# EAGLE design LED_Platine_2x4 (EAGLE 5.00)
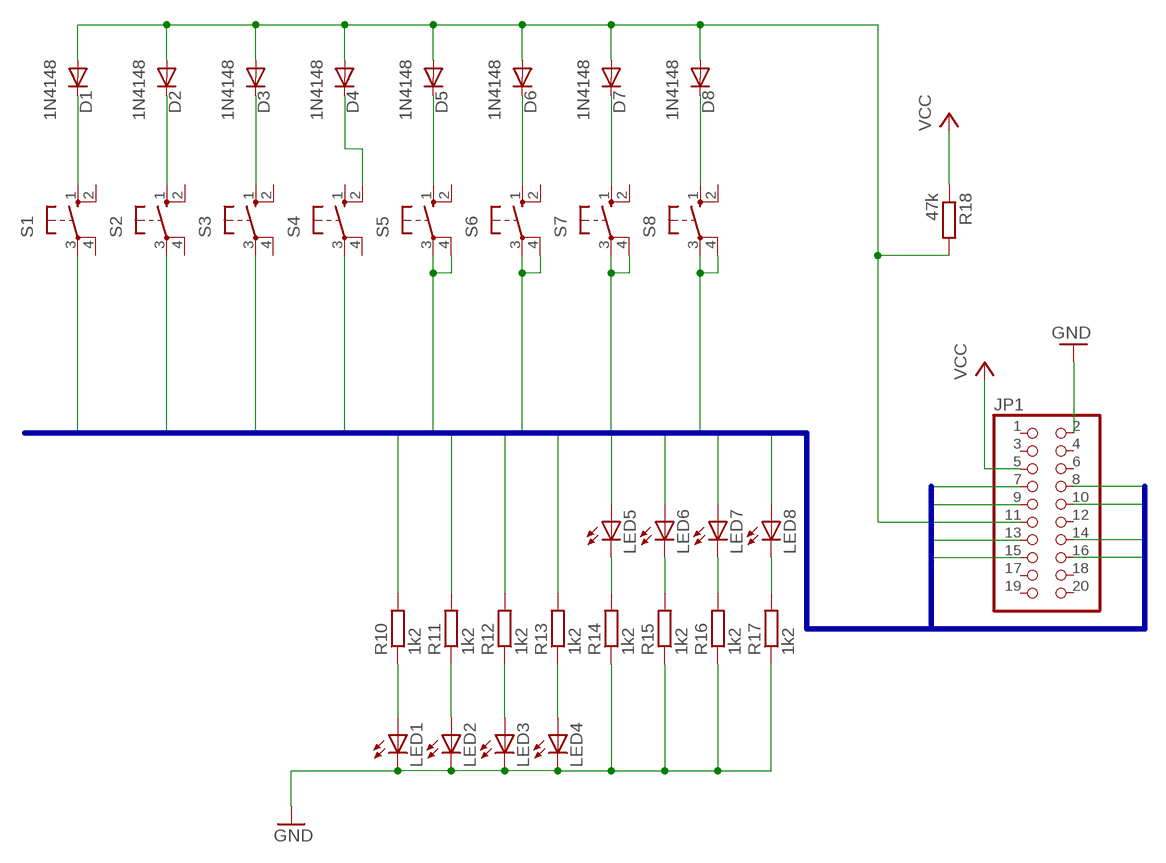
[diagram p0: schematic, sheet 1]

## Parts
D1  1N4148  [DO35-10]
D2  1N4148  [DO35-10]
D3  1N4148  [DO35-10]
D4  1N4148  [DO35-10]
D5  1N4148  [DO35-10]
D6  1N4148  [DO35-10]
D7  1N4148  [DO35-10]
D8  1N4148  [DO35-10]
JP1  PINHD-2X10  [2X10]
LED1  LED3MM  [LED3MM]
LED2  LED3MM  [LED3MM]
LED3  LED3MM  [LED3MM]
LED4  LED3MM  [LED3MM]
LED5  LED3MM  [LED3MM]
LED6  LED3MM  [LED3MM]
LED7  LED3MM  [LED3MM]
LED8  LED3MM  [LED3MM]
R10  1k2  R-EU_0207/10  [0207/10]
R11  1k2  R-EU_0207/10  [0207/10]
R12  1k2  R-EU_0207/10  [0207/10]
R13  1k2  R-EU_0207/10  [0207/10]
R14  1k2  R-EU_0207/10  [0207/10]
R15  1k2  R-EU_0207/10  [0207/10]
R16  1k2  R-EU_0207/10  [0207/10]
R17  1k2  R-EU_0207/10  [0207/10]
R18  47k  R-EU_0207/10  [0207/10]
S1  10-XX  [B3F-10XX]
S2  10-XX  [B3F-10XX]
S3  10-XX  [B3F-10XX]
S4  10-XX  [B3F-10XX]
S5  10-XX  [B3F-10XX]
S6  10-XX  [B3F-10XX]
S7  10-XX  [B3F-10XX]
S8  10-XX  [B3F-10XX]

## Nets
GND: JP1.2 LED1.K(C) LED2.K(C) LED3.K(C) LED4.K(C) R14.1 R15.1 R16.1 R17.1
N$1: D1.C S1.1(S)
N$2: D2.C S2.1(S)
N$3: D3.C S3.1(S)
N$4: D4.C S4.2(S1)
N$6: D5.C S5.1(S)
N$7: D6.C S6.1(S)
N$8: D7.C S7.1(S)
N$10: D8.C S8.1(S)
N$13: D1.A D2.A D3.A D4.A D5.A D6.A D7.A D8.A JP1.11 R18.2
N$14: LED5.K(C) R14.2
N$15: LED1.A R10.1
N$16: LED6.K(C) R15.2
N$17: LED7.K(C) R16.2
N$18: LED8.K(C) R17.2
N$20: LED2.A R11.1
N$21: LED3.A R12.1
N$22: LED4.A R13.1
P0.0: JP1.7 R10.2 S1.3(P)
P0.1: JP1.8 R11.2 S2.3(P)
P0.2: JP1.9 R12.2 S3.3(P)
P0.3: JP1.10 R13.2 S4.3(P)
P0.4: JP1.13 LED5.A S5.3(P) S5.4(P1)
P0.5: JP1.14 LED6.A S6.3(P) S6.4(P1)
P0.6: JP1.15 LED7.A S7.3(P) S7.4(P1)
P0.7: JP1.16 LED8.A S8.3(P) S8.4(P1)
VCC: JP1.5 R18.1
Unconnected: JP1.1 JP1.3 JP1.4 JP1.6 JP1.12 JP1.17 JP1.18 JP1.19 JP1.20 S1.2(S1) S1.4(P1) S2.2(S1) S2.4(P1) S3.2(S1) S3.4(P1) S4.1(S) S4.4(P1) S5.2(S1) S6.2(S1) S7.2(S1) S8.2(S1)

## Buses
P0.[0..7]

## Library data of the parts
D1-D8 = diode:1N4148: DIODE high speed (Philips)
JP1 = pinhead:PINHD-2X10: PIN HEADER
LED1-LED8 = led:LED: LED OSRAM: - CHIPLED LG R971, LG N971, LY N971, LG Q971, LY Q971, LO R971, LY R971 LH N974, LH R974 LS Q976, LO Q976, LY Q976 LO Q996 - Hyper CHIPLED LW Q18S LB Q993, LB Q99A, LB R99A - SideLED LS A670, LO A670, LY A670, LG A670, LP A670 LB A673, LV A673, LT A673, LW A673 LH A674 LY A675 LS A676, LA A676, LO A676, LY A676, LW A676 LS A679, LY A679, LG A679 - Hyper Micro SIDELED® LS Y876, LA Y876, LO Y876, LY Y876 LT Y87S - SmartLED LW L88C, LW L88S LB L89C, LB L89S, LG L890 LS L89K, LO L89K, LY L89K LS L896, LA L896, LO L896, LY L896 - TOPLED LS T670, LO T670, LY T670, LG T670, LP T670 LSG T670, LSP T670, LSY T670, LOP T670, LYG T670 LG T671, LOG T671, LSG T671 LB T673, LV T673, LT T673, LW T673 LH T674 LS T676, LA T676, LO T676, LY T676, LB T676, LH T676, LSB T676, LW T676 LB T67C, LV T67C, LT T67C, LS T67K, LO T67K, LY T67K, LW E67C LS E67B, LA E67B, LO E67B, LY E67B, LB E67C, LV E67C, LT E67C LW T67C LS T679, LY T679, LG T679 LS T770, LO T770, LY T770, LG T770, LP T770 LB T773, LV T773, LT T773, LW T773 LH T774 LS E675, LA E675, LY E675, LS T675 LS T776, LA T776, LO T776, LY T776, LB T776 LHGB T686 LT T68C, LB T68C - Hyper Mini TOPLED® LB M676 - Mini TOPLED Santana® LG M470 LS M47K, LO M47K, LY M47K Source: http://www.osram.convergy.de - LUMILED® LXK2-PW12-R00, LXK2-PW12-S00, LXK2-PW14-U00, LXK2-PW14-V00 LXK2-PM12-R00, LXK2-PM12-S00, LXK2-PM14-U00 LXK2-PE12-Q00, LXK2-PE12-R00, LXK2-PE12-S00, LXK2-PE14-T00, LXK2-PE14-U00 LXK2-PB12-K00, LXK2-PB12-L00, LXK2-PB12-M00, LXK2-PB14-N00, LXK2-PB14-P00, LXK2-PB14-Q00 LXK2-PR12-L00, LXK2-PR12-M00, LXK2-PR14-Q00, LXK2-PR14-R00 LXK2-PD12-Q00, LXK2-PD12-R00, LXK2-PD12-S00 LXK2-PH12-R00, LXK2-PH12-S00 LXK2-PL12-P00, LXK2-PL12-Q00, LXK2-PL12-R00 Source: www.luxeon.com
R10-R18 = rcl:R-EU_: RESISTOR, European symbol
S1-S8 = switch-omron:10-XX: OMRON SWITCH

## Board
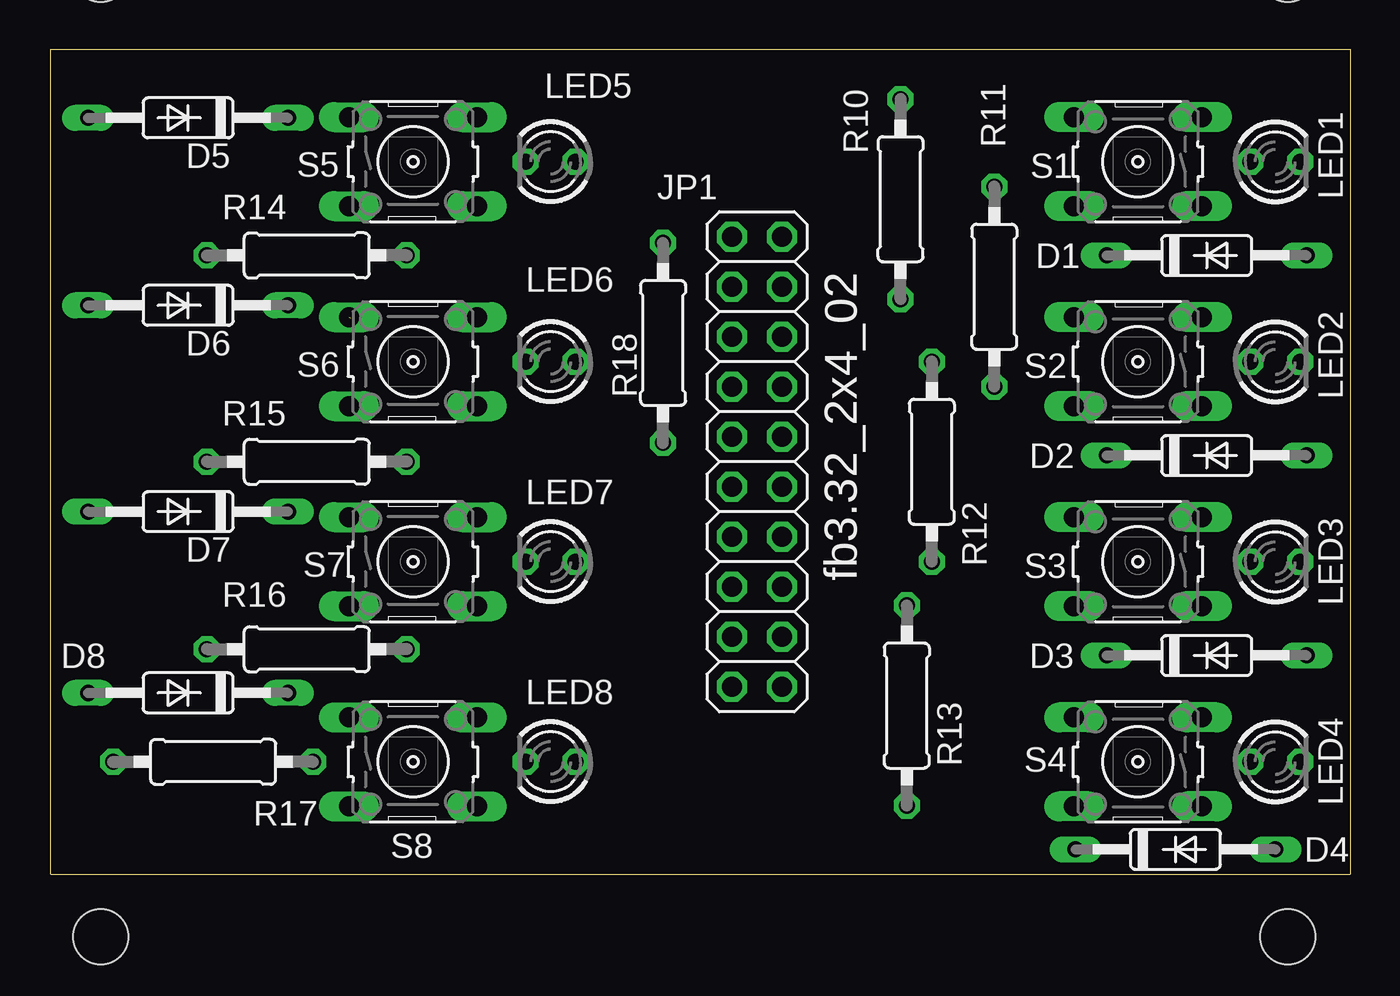
[diagram p1: board, top side]
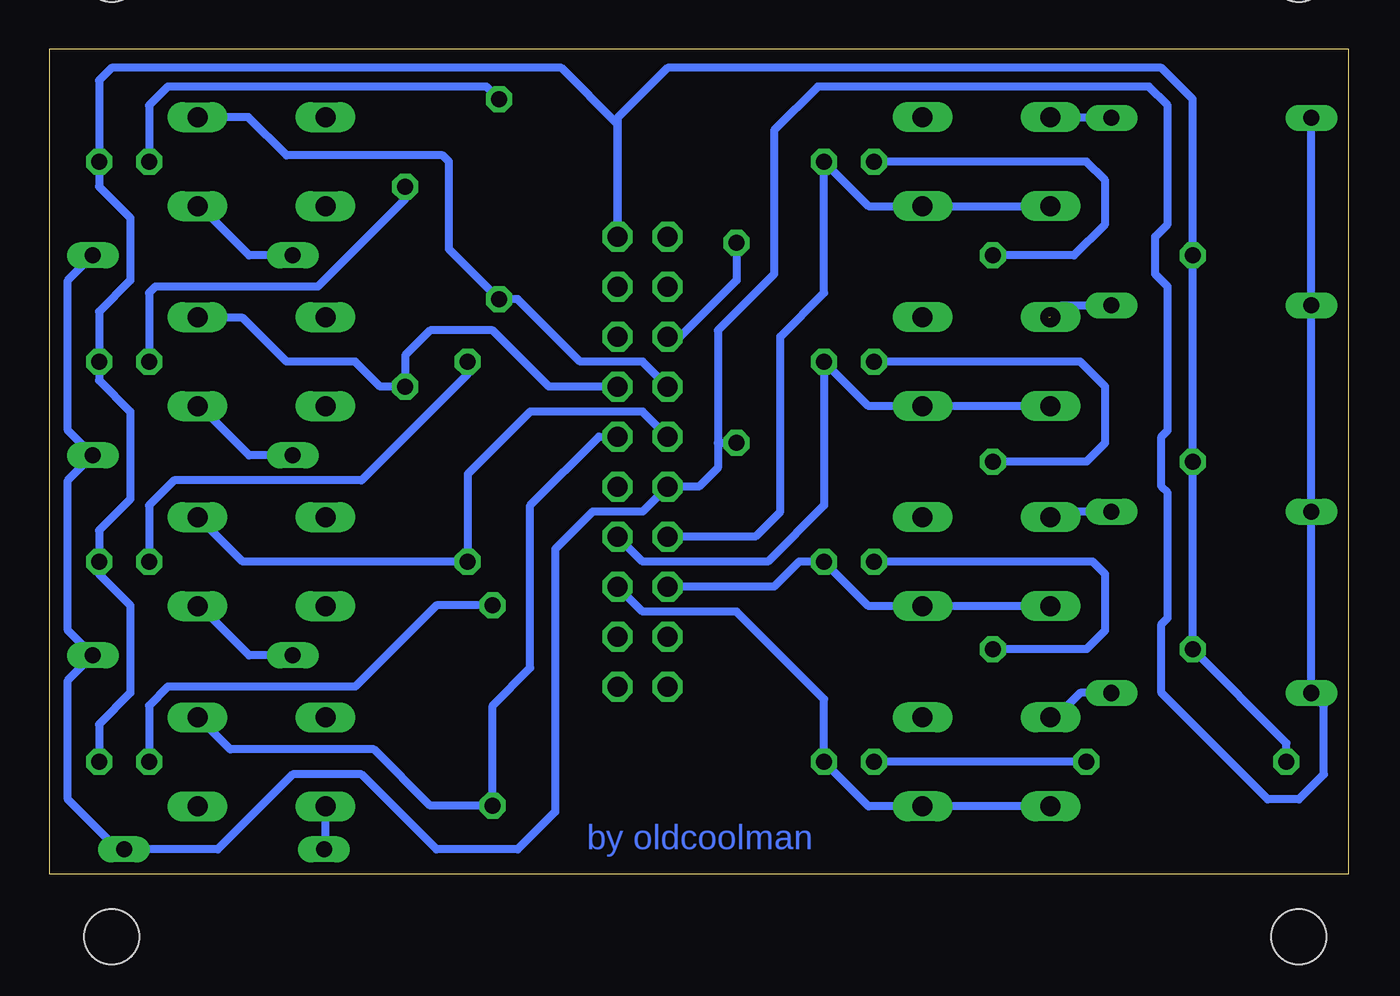
[diagram p2: board, bottom side, seen from below]

Size 66.04 x 41.91 mm. Coordinates in mm from the lower left corner, seen from the top.
Outline: 0,0 0,41.91 66.04,41.91 66.04,0 0,0
Copper layers (1*16): Top 0.035mm / dielectric 1.5mm / Bottom 0.035mm
Design rules "default": minimum track width 10mil, minimum drill 24mil, track to track 12mil, track to pad 12mil, pad to pad 12mil, via to via 12mil, smd to smd 8mil, copper to edge 20mil, drill to drill 8mil, minimum pad ring 10mil, minimum via ring 8mil, stop-mask expansion 4mil, vias tented up to drill 0mil, thermal gap 10mil
Holes 2.8 mm at 2.54,45.72 62.87,45.72 62.87,-3.17 2.54,-3.17

### Footprints (pad centres in the part's own frame; a part is rotated, then mirrored left to right if it is on the bottom)
DO35-10 = drill 0.813 long: A 5.08,0; C -5.08,0
2X10 = drill 1.016 octagon: 1 -11.43,-1.27; 2 -11.43,1.27; 3 -8.89,-1.27; 4 -8.89,1.27; 5 -6.35,-1.27; 6 -6.35,1.27; 7 -3.81,-1.27; 8 -3.81,1.27; 9 -1.27,-1.27; 10 -1.27,1.27; 11 1.27,-1.27; 12 1.27,1.27; 13 3.81,-1.27; 14 3.81,1.27; 15 6.35,-1.27; 16 6.35,1.27; 17 8.89,-1.27; 18 8.89,1.27; 19 11.43,-1.27; 20 11.43,1.27
LED3MM = drill 0.813 octagon: A -1.27,0; K 1.27,0
0207/10 = drill 0.813 octagon: 1 -5.08,0; 2 5.08,0
B3F-10XX = drill 1.016 long: 1 -3.251,2.261; 2 3.251,2.261; 3 -3.251,-2.261; 4 3.251,-2.261

### Placement (x,y rotation side)
D1  58.74,31.43 0 top
D2  58.74,21.27 0 top
D3  58.74,11.11 0 top
D4  57.15,1.27 0 top
D5  6.98,38.42 180 top
D6  6.98,28.89 180 top
D7  6.98,18.41 180 top
D8  6.98,9.21 180 top
JP1  35.88,20.95 270 top
LED1  62.23,36.2 0 top
LED2  62.23,26.03 0 top
LED3  62.23,15.87 0 top
LED4  62.23,5.71 0 top
LED5  25.4,36.2 180 top
LED6  25.4,26.03 180 top
LED7  25.4,15.87 180 top
LED8  25.4,5.71 180 top
R10  43.18,34.29 270 top
R11  47.94,29.84 270 top
R12  44.77,20.95 270 top
R13  43.5,8.57 270 top
R14  13.02,31.43 0 top
R15  13.02,20.95 0 top
R16  13.02,11.43 0 top
R17  8.25,5.71 0 top
R18  31.11,26.99 270 top
S1  55.25,36.2 180 top
S2  55.25,26.03 180 top
S3  55.25,15.87 180 top
S4  55.25,5.71 180 top
S5  18.42,36.2 0 top
S6  18.42,26.03 0 top
S7  18.42,15.87 0 top
S8  18.42,5.71 0 top

### Tracks (layer width: path | path; a pad name or v marks a point on that pad's centre or on a via)
GND
  Bottom 0.406: R17.1 3.18,6.67 R16.1 R15.1 R14.1 7.94,39.37 9.52,40.96 34.61,40.96 37.15,38.42 JP1.2 37.15,38.1 40,40.96 62.87,40.96 63.5,40.32 LED1.K 63.5,34.92 61.91,33.34 61.91,30.16 63.5,28.57 LED2.K 63.5,25.08 61.91,23.49 61.91,19.05 63.5,17.46 LED3.K 63.5,15.24 61.91,13.65 61.91,9.21 63.5,7.62 LED4.K
N$1
  Bottom 0.406: S1.1 58.46,33.93 58.42,33.97 55.88,31.43 D1.C
N$2
  Bottom 0.406: S2.1 58.46,23.77 58.42,23.81 55.88,21.27 D2.C
N$3
  Bottom 0.406: S3.1 58.46,13.61 58.42,13.65 55.88,11.11 D3.C
N$4
  Bottom 0.406: S4.2 51.99,1.35 D4.C
N$5  (via drill 0.6)
  other vias: 2.54,45.72
N$6
  Bottom 0.406: S5.1 15.24,38.46 15.24,38.42 D5.C
N$7  (1 unrouted)
  Bottom 0.406: 15.24,28.26 14.61,28.89 D6.C
N$8
  Bottom 0.406: S7.1 15.16,18.34 15.24,18.42 D7.C
N$9  (via drill 0.6)
  other vias: 2.54,-3.17
N$10
  Bottom 0.406: S8.1 14.96,7.98 14.92,7.94 13.65,9.21 D8.C
N$11  (via drill 0.6)
  other vias: 62.87,45.72
N$12  (via drill 0.6)
  other vias: 62.87,-3.17
N$13
  Bottom 0.406: D5.A D6.A D7.A D8.A 1.27,8.57 1.27,5.08 2.54,3.81 4.13,3.81 9.52,9.21 9.52,12.7 9.21,13.02 9.21,19.37 9.52,19.69 9.52,22.22 9.21,22.54 9.21,29.85 9.84,30.48 9.84,32.39 9.21,33.02 9.21,39.05 10.16,40 26.99,40 29.21,37.78 29.21,30.48 32.07,27.62 32.07,21.91 | 32.07,21.91 32.07,20.64 33.02,19.69 JP1.11 35.88,18.42 38.42,18.42 40.32,16.51 40.32,3.17 42.23,1.27 46.36,1.27 50.17,5.08 53.66,5.08 57.47,1.27 D4.A 62.55,1.27 65.09,3.81 65.09,9.84 D3.A 65.09,12.38 65.09,20 D2.A 65.09,22.54 65.09,30.16 D1.A | 32.07,21.91 R18.2
N$14
  Bottom 0.406: LED5.K 13.33,36.2 12.38,35.24 12.38,33.02 13.97,31.43 R14.2
N$15
  Bottom 0.406: R10.1 43.81,40 60.01,40 60.96,39.05 LED1.A
N$16
  Bottom 0.406: LED6.K 13.65,26.03 12.38,24.77 12.38,21.91 13.33,20.96 R15.2
N$17
  Bottom 0.406: LED7.K 13.02,15.87 12.38,15.24 12.38,12.38 13.33,11.43 R16.2
N$18
  Bottom 0.406: R17.2 LED8.K
N$20
  Bottom 0.406: R11.1 47.94,34.29 52.39,29.85 60.64,29.85 60.96,29.53 LED2.A
N$21
  Bottom 0.406: R12.1 44.77,25.4 50.17,20 59.69,20 60.96,18.73 60.96,16.19 | 60.96,16.19 60.64,15.87 LED3.A 60.96,16.19
N$22
  Bottom 0.406: R13.1 46.36,13.65 50.48,9.53 60.01,9.53 60.96,8.57 LED4.A
P0.0
  Bottom 0.406: S1.3 55.92,38.46 53.98,36.51 46.04,36.51 45.72,36.2 45.72,31.75 R10.2 42.23,29.21 39.05,26.03 35.88,26.03 JP1.7
P0.1
  Bottom 0.406: S2.3 58.46,28.3 58.42,28.26 56.2,28.26 53.98,26.03 50.48,26.03 49.21,24.77 R11.2 47.94,26.35 46.67,27.62 43.5,27.62 40.64,24.77 JP1.8
P0.2
  Bottom 0.406: JP1.9 35.88,23.49 41.59,23.49 44.77,20.32 R12.2 56.2,15.87 58.46,18.14 S3.3
P0.3
  Bottom 0.406: JP1.10 38.1,22.22 41.59,18.73 41.59,10.48 43.5,8.57 R13.2 46.67,3.49 49.53,6.35 56.83,6.35 58.46,7.98 S4.3
P0.4
  Bottom 0.406: S5.4 24.41,33.93 LED5.A 26.67,29.53 28.89,27.31 28.89,18.42 30.16,17.15 JP1.13 | S5.4 21.59,33.93 | 21.59,33.93 S5.3 | 21.59,33.93 21.59,33.97 21.63,33.97 S5.4
P0.5
  Bottom 0.406: S6.3 21.59,23.77 | 21.59,23.77 S6.4 | S6.4 24.41,23.77 LED6.A 26.67,18.73 29.53,15.87 35.88,15.87 JP1.14 | 21.59,23.77 21.59,23.81 21.63,23.81 S6.4
P0.6
  Bottom 0.406: S7.3 21.59,13.61 | 21.59,13.61 S7.4 | S7.4 24.41,13.61 LED7.A 27.94,15.87 29.21,14.6 JP1.15 | 21.59,13.61 21.59,13.65 21.63,13.65 S7.4
P0.7
  Bottom 0.406: S8.3 21.59,3.45 | 21.59,3.45 S8.4 | S8.4 24.41,3.45 LED8.A 26.67,8.89 31.11,13.33 35.88,13.33 JP1.16 | 21.59,3.45 21.59,3.49 21.63,3.49 S8.4
VCC
  Bottom 0.406: JP1.5 33.97,27.31 31.11,30.16 R18.1

### Text on the board
Bottom: by oldcoolman
tPlace: fb3.32_2x4_02
tDocu: optional,falls nicht auf controller-->